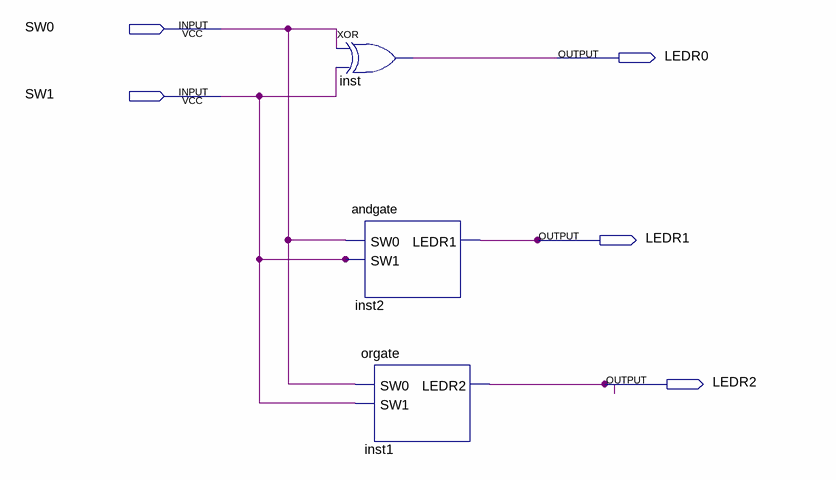
[diagram p0: schematic sheet]
// Quartus schematic hw1.bdf as structural Verilog: 3 symbols, 5 pins
module hw1 (
  input  SW0,
  input  SW1,
  output LEDR0,
  output LEDR1,
  output LEDR2
);

  xor inst (LEDR0, SW0, SW1);
  andgate inst2 (.SW0(SW0), .SW1(SW1), .LEDR1(LEDR1));
  orgate inst1 (.SW0(SW0), .SW1(SW1), .LEDR2(LEDR2));
endmodule
